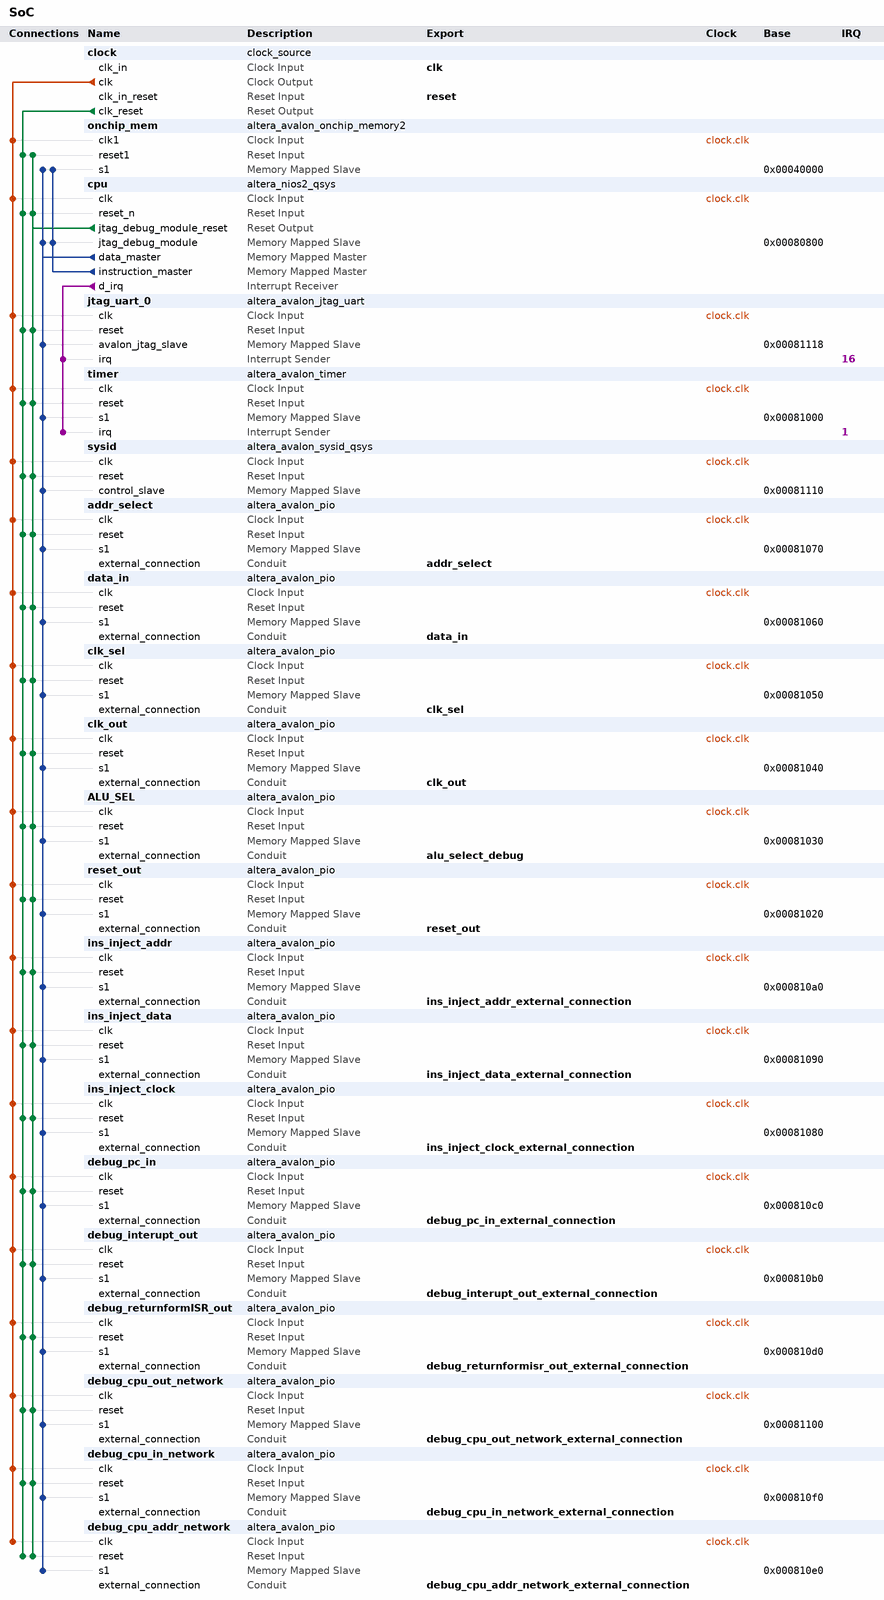
[diagram p0: system contents]
# Platform Designer (Qsys) system SoC, Cyclone IV E EP4CE115F29C7
# Parameters at their usual value, and those the tool derives, are not listed.
package require -exact qsys 12.1
create_system SoC
set_project_property DEVICE_FAMILY {Cyclone IV E}
set_project_property DEVICE EP4CE115F29C7

add_instance clock clock_source 12.1
set_instance_parameter_value clock clockFrequency 50000000

add_instance onchip_mem altera_avalon_onchip_memory2 12.1
set_instance_parameter_value onchip_mem dataWidth 32
set_instance_parameter_value onchip_mem dualPort false
set_instance_parameter_value onchip_mem initMemContent true
set_instance_parameter_value onchip_mem initializationFileName onchip_mem
set_instance_parameter_value onchip_mem memorySize 262144

add_instance cpu altera_nios2_qsys 12.1
set_instance_parameter_value cpu resetSlave onchip_mem.s1
set_instance_parameter_value cpu exceptionSlave onchip_mem.s1
set_instance_parameter_value cpu breakSlave cpu.jtag_debug_module
set_instance_parameter_value cpu muldiv_multiplierType NoneSmall
set_instance_parameter_value cpu impl Small
set_instance_parameter_value cpu icache_size 4096

add_instance jtag_uart_0 altera_avalon_jtag_uart 12.1
set_instance_parameter_value jtag_uart_0 simInteractiveOptions INTERACTIVE_ASCII_OUTPUT

add_instance timer altera_avalon_timer 12.1
set_instance_parameter_value timer period 1
set_instance_parameter_value timer periodUnits MSEC
set_instance_parameter_value timer timerPreset FULL_FEATURED

add_instance sysid altera_avalon_sysid_qsys 12.1
set_instance_parameter_value sysid id 0

add_instance addr_select altera_avalon_pio 12.1
set_instance_parameter_value addr_select direction Output
set_instance_parameter_value addr_select width 5

add_instance data_in altera_avalon_pio 12.1
set_instance_parameter_value data_in direction Input
set_instance_parameter_value data_in width 32

add_instance clk_sel altera_avalon_pio 12.1
set_instance_parameter_value clk_sel direction Output
set_instance_parameter_value clk_sel width 1

add_instance clk_out altera_avalon_pio 12.1
set_instance_parameter_value clk_out direction Output
set_instance_parameter_value clk_out width 1

add_instance ALU_SEL altera_avalon_pio 12.1
set_instance_parameter_value ALU_SEL direction Input
set_instance_parameter_value ALU_SEL width 32

add_instance reset_out altera_avalon_pio 12.1
set_instance_parameter_value reset_out direction Output
set_instance_parameter_value reset_out width 1

add_instance ins_inject_addr altera_avalon_pio 12.1
set_instance_parameter_value ins_inject_addr direction Output
set_instance_parameter_value ins_inject_addr width 10

add_instance ins_inject_data altera_avalon_pio 12.1
set_instance_parameter_value ins_inject_data direction Output
set_instance_parameter_value ins_inject_data width 8

add_instance ins_inject_clock altera_avalon_pio 12.1
set_instance_parameter_value ins_inject_clock direction Output
set_instance_parameter_value ins_inject_clock width 1

add_instance debug_pc_in altera_avalon_pio 12.1
set_instance_parameter_value debug_pc_in direction Input
set_instance_parameter_value debug_pc_in width 32

add_instance debug_interupt_out altera_avalon_pio 12.1
set_instance_parameter_value debug_interupt_out direction Output
set_instance_parameter_value debug_interupt_out width 1

add_instance debug_returnformISR_out altera_avalon_pio 12.1
set_instance_parameter_value debug_returnformISR_out direction Output
set_instance_parameter_value debug_returnformISR_out width 1

add_instance debug_cpu_out_network altera_avalon_pio 12.1
set_instance_parameter_value debug_cpu_out_network direction Input
set_instance_parameter_value debug_cpu_out_network width 32

add_instance debug_cpu_in_network altera_avalon_pio 12.1
set_instance_parameter_value debug_cpu_in_network direction Output
set_instance_parameter_value debug_cpu_in_network width 32

add_instance debug_cpu_addr_network altera_avalon_pio 12.1
set_instance_parameter_value debug_cpu_addr_network direction Output
set_instance_parameter_value debug_cpu_addr_network width 32

# connections
add_connection clock.clk addr_select.clk clock
add_connection clock.clk ALU_SEL.clk clock
add_connection clock.clk clk_out.clk clock
add_connection clock.clk clk_sel.clk clock
add_connection clock.clk cpu.clk clock
add_connection clock.clk data_in.clk clock
add_connection clock.clk debug_cpu_addr_network.clk clock
add_connection clock.clk debug_cpu_in_network.clk clock
add_connection clock.clk debug_cpu_out_network.clk clock
add_connection clock.clk debug_interupt_out.clk clock
add_connection clock.clk debug_pc_in.clk clock
add_connection clock.clk debug_returnformISR_out.clk clock
add_connection clock.clk ins_inject_addr.clk clock
add_connection clock.clk ins_inject_clock.clk clock
add_connection clock.clk ins_inject_data.clk clock
add_connection clock.clk jtag_uart_0.clk clock
add_connection clock.clk onchip_mem.clk1 clock
add_connection clock.clk reset_out.clk clock
add_connection clock.clk sysid.clk clock
add_connection clock.clk timer.clk clock
add_connection clock.clk_reset addr_select.reset reset
add_connection clock.clk_reset ALU_SEL.reset reset
add_connection clock.clk_reset clk_out.reset reset
add_connection clock.clk_reset clk_sel.reset reset
add_connection clock.clk_reset cpu.reset_n reset
add_connection clock.clk_reset data_in.reset reset
add_connection clock.clk_reset debug_cpu_addr_network.reset reset
add_connection clock.clk_reset debug_cpu_in_network.reset reset
add_connection clock.clk_reset debug_cpu_out_network.reset reset
add_connection clock.clk_reset debug_interupt_out.reset reset
add_connection clock.clk_reset debug_pc_in.reset reset
add_connection clock.clk_reset debug_returnformISR_out.reset reset
add_connection clock.clk_reset ins_inject_addr.reset reset
add_connection clock.clk_reset ins_inject_clock.reset reset
add_connection clock.clk_reset ins_inject_data.reset reset
add_connection clock.clk_reset jtag_uart_0.reset reset
add_connection clock.clk_reset onchip_mem.reset1 reset
add_connection clock.clk_reset reset_out.reset reset
add_connection clock.clk_reset sysid.reset reset
add_connection clock.clk_reset timer.reset reset
add_connection cpu.jtag_debug_module_reset addr_select.reset reset
add_connection cpu.jtag_debug_module_reset ALU_SEL.reset reset
add_connection cpu.jtag_debug_module_reset clk_out.reset reset
add_connection cpu.jtag_debug_module_reset clk_sel.reset reset
add_connection cpu.jtag_debug_module_reset cpu.reset_n reset
add_connection cpu.jtag_debug_module_reset data_in.reset reset
add_connection cpu.jtag_debug_module_reset debug_cpu_addr_network.reset reset
add_connection cpu.jtag_debug_module_reset debug_cpu_in_network.reset reset
add_connection cpu.jtag_debug_module_reset debug_cpu_out_network.reset reset
add_connection cpu.jtag_debug_module_reset debug_interupt_out.reset reset
add_connection cpu.jtag_debug_module_reset debug_pc_in.reset reset
add_connection cpu.jtag_debug_module_reset debug_returnformISR_out.reset reset
add_connection cpu.jtag_debug_module_reset ins_inject_addr.reset reset
add_connection cpu.jtag_debug_module_reset ins_inject_clock.reset reset
add_connection cpu.jtag_debug_module_reset ins_inject_data.reset reset
add_connection cpu.jtag_debug_module_reset jtag_uart_0.reset reset
add_connection cpu.jtag_debug_module_reset onchip_mem.reset1 reset
add_connection cpu.jtag_debug_module_reset reset_out.reset reset
add_connection cpu.jtag_debug_module_reset sysid.reset reset
add_connection cpu.jtag_debug_module_reset timer.reset reset
add_connection cpu.data_master addr_select.s1 avalon
set_connection_parameter_value cpu.data_master/addr_select.s1 baseAddress 0x00081070
add_connection cpu.data_master ALU_SEL.s1 avalon
set_connection_parameter_value cpu.data_master/ALU_SEL.s1 baseAddress 0x00081030
add_connection cpu.data_master clk_out.s1 avalon
set_connection_parameter_value cpu.data_master/clk_out.s1 baseAddress 0x00081040
add_connection cpu.data_master clk_sel.s1 avalon
set_connection_parameter_value cpu.data_master/clk_sel.s1 baseAddress 0x00081050
add_connection cpu.data_master cpu.jtag_debug_module avalon
set_connection_parameter_value cpu.data_master/cpu.jtag_debug_module baseAddress 0x00080800
add_connection cpu.data_master data_in.s1 avalon
set_connection_parameter_value cpu.data_master/data_in.s1 baseAddress 0x00081060
add_connection cpu.data_master debug_cpu_addr_network.s1 avalon
set_connection_parameter_value cpu.data_master/debug_cpu_addr_network.s1 baseAddress 0x000810e0
add_connection cpu.data_master debug_cpu_in_network.s1 avalon
set_connection_parameter_value cpu.data_master/debug_cpu_in_network.s1 baseAddress 0x000810f0
add_connection cpu.data_master debug_cpu_out_network.s1 avalon
set_connection_parameter_value cpu.data_master/debug_cpu_out_network.s1 baseAddress 0x00081100
add_connection cpu.data_master debug_interupt_out.s1 avalon
set_connection_parameter_value cpu.data_master/debug_interupt_out.s1 baseAddress 0x000810b0
add_connection cpu.data_master debug_pc_in.s1 avalon
set_connection_parameter_value cpu.data_master/debug_pc_in.s1 baseAddress 0x000810c0
add_connection cpu.data_master debug_returnformISR_out.s1 avalon
set_connection_parameter_value cpu.data_master/debug_returnformISR_out.s1 baseAddress 0x000810d0
add_connection cpu.data_master ins_inject_addr.s1 avalon
set_connection_parameter_value cpu.data_master/ins_inject_addr.s1 baseAddress 0x000810a0
add_connection cpu.data_master ins_inject_clock.s1 avalon
set_connection_parameter_value cpu.data_master/ins_inject_clock.s1 baseAddress 0x00081080
add_connection cpu.data_master ins_inject_data.s1 avalon
set_connection_parameter_value cpu.data_master/ins_inject_data.s1 baseAddress 0x00081090
add_connection cpu.data_master jtag_uart_0.avalon_jtag_slave avalon
set_connection_parameter_value cpu.data_master/jtag_uart_0.avalon_jtag_slave baseAddress 0x00081118
add_connection cpu.data_master onchip_mem.s1 avalon
set_connection_parameter_value cpu.data_master/onchip_mem.s1 baseAddress 0x00040000
add_connection cpu.data_master reset_out.s1 avalon
set_connection_parameter_value cpu.data_master/reset_out.s1 baseAddress 0x00081020
add_connection cpu.data_master sysid.control_slave avalon
set_connection_parameter_value cpu.data_master/sysid.control_slave baseAddress 0x00081110
add_connection cpu.data_master timer.s1 avalon
set_connection_parameter_value cpu.data_master/timer.s1 baseAddress 0x00081000
add_connection cpu.instruction_master cpu.jtag_debug_module avalon
set_connection_parameter_value cpu.instruction_master/cpu.jtag_debug_module baseAddress 0x00080800
add_connection cpu.instruction_master onchip_mem.s1 avalon
set_connection_parameter_value cpu.instruction_master/onchip_mem.s1 baseAddress 0x00040000
add_connection cpu.d_irq jtag_uart_0.irq interrupt
set_connection_parameter_value cpu.d_irq/jtag_uart_0.irq irqNumber 16
add_connection cpu.d_irq timer.irq interrupt
set_connection_parameter_value cpu.d_irq/timer.irq irqNumber 1

# exported interfaces
add_interface clk clock sink
set_interface_property clk EXPORT_OF clock.clk_in
add_interface reset reset sink
set_interface_property reset EXPORT_OF clock.clk_in_reset
add_interface addr_select conduit end
set_interface_property addr_select EXPORT_OF addr_select.external_connection
add_interface data_in conduit end
set_interface_property data_in EXPORT_OF data_in.external_connection
add_interface clk_sel conduit end
set_interface_property clk_sel EXPORT_OF clk_sel.external_connection
add_interface clk_out conduit end
set_interface_property clk_out EXPORT_OF clk_out.external_connection
add_interface alu_select_debug conduit end
set_interface_property alu_select_debug EXPORT_OF ALU_SEL.external_connection
add_interface reset_out conduit end
set_interface_property reset_out EXPORT_OF reset_out.external_connection
add_interface ins_inject_addr_external_connection conduit end
set_interface_property ins_inject_addr_external_connection EXPORT_OF ins_inject_addr.external_connection
add_interface ins_inject_data_external_connection conduit end
set_interface_property ins_inject_data_external_connection EXPORT_OF ins_inject_data.external_connection
add_interface ins_inject_clock_external_connection conduit end
set_interface_property ins_inject_clock_external_connection EXPORT_OF ins_inject_clock.external_connection
add_interface debug_pc_in_external_connection conduit end
set_interface_property debug_pc_in_external_connection EXPORT_OF debug_pc_in.external_connection
add_interface debug_interupt_out_external_connection conduit end
set_interface_property debug_interupt_out_external_connection EXPORT_OF debug_interupt_out.external_connection
add_interface debug_returnformisr_out_external_connection conduit end
set_interface_property debug_returnformisr_out_external_connection EXPORT_OF debug_returnformISR_out.external_connection
add_interface debug_cpu_out_network_external_connection conduit end
set_interface_property debug_cpu_out_network_external_connection EXPORT_OF debug_cpu_out_network.external_connection
add_interface debug_cpu_in_network_external_connection conduit end
set_interface_property debug_cpu_in_network_external_connection EXPORT_OF debug_cpu_in_network.external_connection
add_interface debug_cpu_addr_network_external_connection conduit end
set_interface_property debug_cpu_addr_network_external_connection EXPORT_OF debug_cpu_addr_network.external_connection

save_system SoC.qsys
